# Altium schematic sheet CAN.SchDoc
size A4
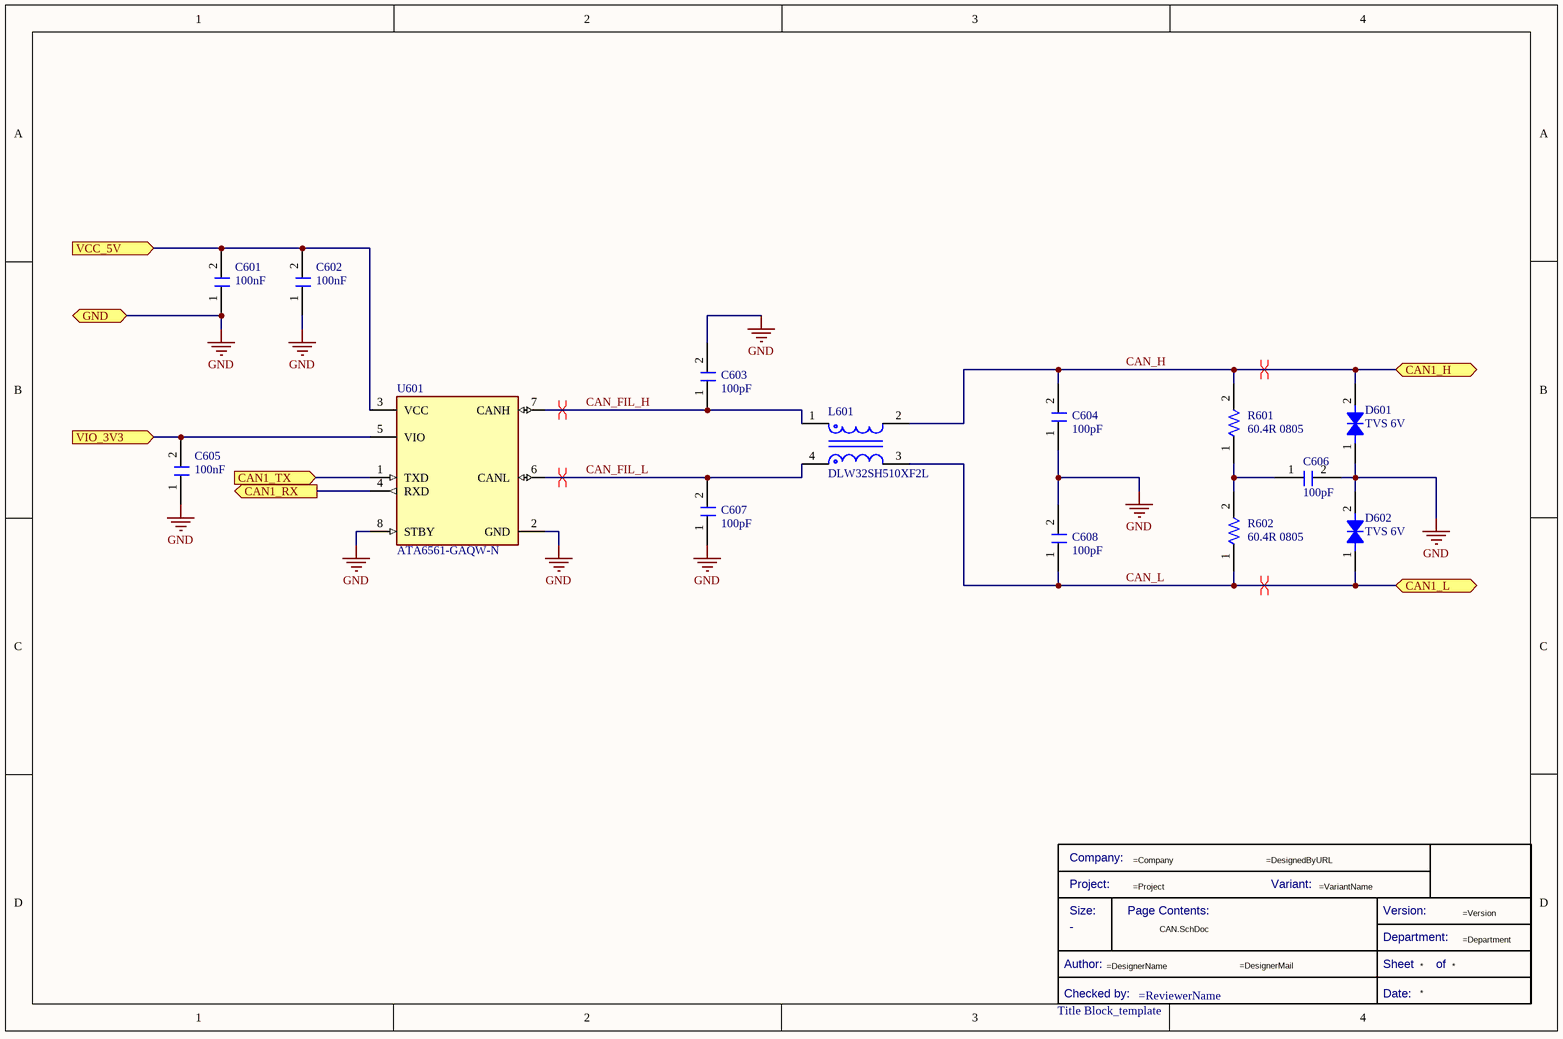
[diagram p0: CAN.SchDoc]

## Parts
*  Title Block_template  (graphical)
C601  value 100nF  [C0805FNPC-R]  (hidden comment: C100n-50V-0805FNPC-X7R)
C602  value 100nF  [C0805FNPC-R]  (hidden comment: C100n-50V-0805FNPC-X7R)
C603  value 100pF  [C0805FNPC-W]  (hidden comment: C100p-50V-0805FNPC-C0G/NP0)
C604  value 100pF  [C0805FNPC-W]  (hidden comment: C100p-50V-0805FNPC-C0G/NP0)
C605  value 100nF  [C0805FNPC-R]  (hidden comment: C100n-50V-0805FNPC-X7R)
C606  value 100pF  [C0805FNPC-W]  (hidden comment: C100p-50V-0805FNPC-C0G/NP0)
C607  value 100pF  [C0805FNPC-W]  (hidden comment: C100p-50V-0805FNPC-C0G/NP0)
C608  value 100pF  [C0805FNPC-W]  (hidden comment: C100p-50V-0805FNPC-C0G/NP0)
D601  TVS 6V  [DTVS-DO-214AC]
D602  TVS 6V  [DTVS-DO-214AC]
L601  DLW32SH510XF2L  [FP-DLW32PH-MFG]
R601  value 60.4R 0805  [R0805FTK]  (hidden comment: R60-0805FTN)
R602  value 60.4R 0805  [R0805FTK]  (hidden comment: R60-0805FTN)
U601  ATA6561-GAQW-N  [FP-C04-057-OA-MFG]

## Ports
CAN1_H (bidir), CAN1_L (bidir), CAN1_RX (out), CAN1_TX (in), GND (bidir), VCC_5V (in), VIO_3V3 (in)

## Nets
GND: C601.1 C602.1 C603.2 C604.1 C605.1 C606.2 C607.1 C608.2 D601.1 D602.2 U601.2(GND) U601.8(STBY) ; port GND
CAN1_RX: U601.4(RXD) ; port CAN1_RX
CAN1_TX: U601.1(TXD) ; port CAN1_TX
CAN_FIL_H: C603.1 L601.1 U601.7(CANH)
CAN_FIL_L: C607.2 L601.4 U601.6(CANL)
CAN_H: C604.2 D601.2 L601.2 R601.2 ; port CAN1_H
CAN_L: C608.1 D602.1 L601.3 R602.1 ; port CAN1_L
VCC_5V: C601.2 C602.2 U601.3(VCC) ; port VCC_5V
VIO_3V3: C605.2 U601.5(VIO) ; port VIO_3V3
NetC606_1: C606.1 R601.1 R602.2

## Layout directives
differential pair: CAN_FIL_H, CAN_FIL_L, CAN_H, CAN_L

## Notes on the sheet
- (in symbol CMP-00043-2) Company:; Project:; Variant:; Size:; Page Contents:; Version:; Department:; Author:; Sheet; of; Checked by:; Date:

## Library data of the parts
* = CMP-00043-2: Standard Title Block; .Creator: GP; Checked by:: =ReviewerName; Size: -; Design Item ID: Title Block_template; Category: Title Block; .PCBcheck: GP; Source: e-Tech_Racing.SchLib; .SCHcheck: GP
C601 C602 C605 = CMP-00063-1: Cap, 0.1ΜF, 50V, 10%, X7R, 0805; Manufacturer 1: Wurth Electronics; Manufacturer Part Number 1: 885012207098; .Creator: DR; Pricing 1: 100=0,10200, 500=0,07100, 2000=0,06100 (GBP); ComponentLink1URL: http://www.farnell.com/datasheets/1958498.pdf?src-supplier=Farnell; Design Item ID: C100n-50V-0805FNPC-X7R; Voltage Rating (DC): 50V; Voltage Rating: 50V; Max Operating Temperature: 125°C; RoHS: Yes; Case Code (Metric): 2012; Mount: Surface Mount; REACH SVHC: Unknown; Stock 1: 8000; Source: Passives.SchLib; Tolerance: 10%; RoHS Compliant: Yes; Dielectric: X7R; ComponentLink2Description: http://www.farnell.com/datasheets/1958498.pdf?src-supplier=Element14; ComponentLink2URL: http://www.farnell.com/datasheets/1958498.pdf?src-supplier=Element14; Min Operating Temperature: -55°C; Width: 0.049inch; Category: Ceramic Capacitors; Thickness: 0.035inch; Length: 0.079inch; ComponentLink3URL: https://katalog.we-online.de/pbs/datasheet/885012207098.pdf?src-supplier=Digi-Key; Case/Package: 0805; ComponentLink3Description: https://katalog.we-online.de/pbs/datasheet/885012207098.pdf?src-supplier=Digi-Key; Packaging: Cut Tape; ComponentLink1Description: http://www.farnell.com/datasheets/1958498.pdf?src-supplier=Farnell; ComponentLink4Description: http://www.farnell.com/datasheets/1958498.pdf?src-supplier=Newark; ComponentLink4URL: http://www.farnell.com/datasheets/1958498.pdf?src-supplier=Newark
C603 C604 C606-C608 = CMP-00068-1: Multilayer Ceramic Capacitor, Wcap-Csgp Series, 100 Pf, 5%, C0G / Np0, 50 V, 0805 [2012 Metric] Rohs Compliant: Yes; Manufacturer Part Number: 885012007057; Manufacturer: Wurth Electronics; Voltage Rating (DC): 50V; .Creator: DR; Pricing 1: 4000=0,03900, 12000=0,03800 (USD); Case/Package: 0805; Packaging: Cut Tape; ComponentLink3URL: http://www.farnell.com/datasheets/1958443.pdf?src-supplier=Element14; Dielectric: C0G; Design Item ID: C100p-50V-0805FNPC-C0G/NP0; ComponentLink2URL: https://katalog.we-online.de/pbs/datasheet/885012007057.pdf?src-supplier=Digi-Key; Length: 0.079inch; Case Code (Metric): 2012; Stock 1: 1; ComponentLink1URL: http://www.farnell.com/datasheets/1958443.pdf?src-supplier=Farnell; Category: Ceramic Capacitors; ComponentLink5URL: https://www.we-online.com/catalog/en/WCAP-CSGP-50VDC#885012007057; Mount: Surface Mount; Thickness: 0.035inch; ComponentLink4Description: http://www.farnell.com/datasheets/1958443.pdf?src-supplier=Newark; REACH SVHC: Unknown; ComponentLink3Description: http://www.farnell.com/datasheets/1958443.pdf?src-supplier=Element14; Source: Passives.SchLib; ComponentLink1Description: http://www.farnell.com/datasheets/1958443.pdf?src-supplier=Farnell; ComponentLink5Description: Where buy it; RoHS Compliant: Yes; ComponentLink2Description: https://katalog.we-online.de/pbs/datasheet/885012007057.pdf?src-supplier=Digi-Key; Width: 0.049inch; ComponentLink4URL: http://www.farnell.com/datasheets/1958443.pdf?src-supplier=Newark; Voltage Rating: 50V; Min Operating Temperature: -55°C; Max Operating Temperature: 125°C; Tolerance: 5%; RoHS: Yes
D601 D602 = CMP-00154-1: TVS diode [Würth Elektronik] 824501600 TVS diode; Manufacturer: Wurth Electronics; Power Line Protection: No; Forward Voltage: 7.02V; Number of Bidirectional Channels: 1; Peak Pulse Current: 38.8A; .Creator: DO; Polarity: Bidirectional; Peak Pulse Power: 400W; Clamping Voltage: 10.3V; ComponentLink2Description: http://www.farnell.com/datasheets/2036401.pdf?src-supplier=Element14; Source: Filter components.SchLib; ComponentLink3URL: https://katalog.we-online.de/pbs/datasheet/824501600.pdf?src-supplier=Digi-Key; Mount: Surface Mount; Design Item ID: DTVS-6V-DO-214AC; ComponentLink3Description: https://katalog.we-online.de/pbs/datasheet/824501600.pdf?src-supplier=Digi-Key; RoHS: Yes; Resistor Type: Zener; REACH SVHC: Unknown; Pins: 2; Min Breakdown Voltage: 7.02V; Min Operating Temperature: -65°C; ComponentLink1URL: https://www.we-online.com/catalog/en/WE-TVSP?sq=824501600#824501600; Reverse Standoff Voltage: 6V; Stock 1: 780; Pricing 1: 1=0,28000, 10=0,26100, 50=0,26100, 100=0,23400, 500=0,20400, 1000=0,17400, 10000=0,17400 (USD); ComponentLink2URL: http://www.farnell.com/datasheets/2036401.pdf?src-supplier=Element14; Category: TVS Diodes; ComponentLink1Description: Where buy it; Manufacturer Part Number: 824501600; Packaging: Cut Tape; RoHS Compliant: Yes; Max Operating Temperature: 150°C
L601 = CMP-006-00001-1: Cmc 51UH 200MA 2LN SMD AEC-Q200
R601 R602 = CMP-00080-1: Res Thin Film 0805 60.4 Ohm 0.1% 1/8W ±25ppm/°C Molded SMD SMD Punched Carrier T/R; Manufacturer 1: Panasonic; Manufacturer Part Number 1: ERA-6AEB60R4V; Voltage Rating (DC): 100V; Power Rating: 125mW; Voltage Rating: 200V; .Creator: DR; Lead Free: Lead Free; ComponentLink4URL: https://datasheet.ciiva.com/30184/54aoa0000ce26-30184022.pdf?src-supplier=Onlinecomponents.com; Source: Passives.SchLib; Radiation Hardening: No; ComponentLink5Description: https://datasheet.ciiva.com/9188/aoa0000ce26-9188476.pdf?src-supplier=Avnet; Depth: 1.25mm; Length: 2mm; ComponentLink3Description: https://datasheet.ciiva.com/5951/485442-5951173.pdf?src-supplier=Farnell; RoHS: Yes; Tolerance: 0.1%; Termination: SMD/SMT; ComponentLink1Description: https://datasheet.ciiva.com/11811/0900766b80eb1d8c-11811180.pdf?src-supplier=RSComponents; Max Power Dissipation: 125mW; Package Quantity: 5000; Mount: Surface Mount; Number of Terminations: 2; Temperature Coefficient: 25ppm/°C; Case/Package: 0805; Packaging: Tape and Reel; Contact Plating: Tin; Category: Chip SMD Resistors; ComponentLink1URL: https://datasheet.ciiva.com/11811/0900766b80eb1d8c-11811180.pdf?src-supplier=RSComponents; Features: Automotive AEC-Q200; Weight: 0.000194oz; Resistor Type: Thin Film,Metal Film; Design Item ID: R60-0805FTN; Stock 1: 5000; Case Code (Metric): 2012; ComponentLink2Description: https://datasheet.ciiva.com/41450/001181146-da-01-en-widerstand-era-0805-60r4-0-1-5000st-41450303.pdf?src-supplier=Conrad; ComponentLink4Description: https://datasheet.ciiva.com/30184/54aoa0000ce26-30184022.pdf?src-supplier=Onlinecomponents.com; ComponentLink3URL: https://datasheet.ciiva.com/5951/485442-5951173.pdf?src-supplier=Farnell; Max Operating Temperature: 155°C; Pricing 1: 1=0,04650, 10=0,03900, 100=0,02860 (USD); ComponentLink2URL: https://datasheet.ciiva.com/41450/001181146-da-01-en-widerstand-era-0805-60r4-0-1-5000st-41450303.pdf?src-supplier=Conrad; ComponentLink5URL: https://datasheet.ciiva.com/9188/aoa0000ce26-9188476.pdf?src-supplier=Avnet; Min Operating Temperature: -55°C; Pins: 2; Width: 1.25mm; Height: 0.5mm
U601 = CMP-015-00000-1: CAN Transceiver, 1-Trnsvr, PDSO8; RoHS Compliant: Yes